# EAGLE schematic FM-Super-Regen-Alt (EAGLE 7.7.0)
Super-Regen FM Radio: "Radio Shack Special" http://ryanzachry.com/2013/01/super-regen-fm-radio/
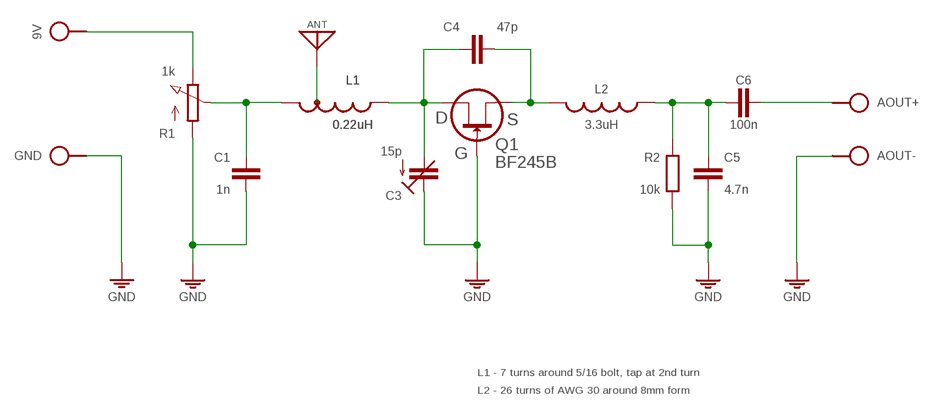
[diagram p0: schematic, sheet 1]

## Parts
9V  SPAD  [SPAD]
ANT  ANT  [SPAD]
AOUT+  SPAD  [SPAD]
AOUT-  SPAD  [SPAD]
C1  1n  C050-020X036/V  [C050-020X036/V]
C3  15p  C-TR-PH201272222-808-2PIN  [TRIM-2222-808]
C4  47p  C050-020X036  [C050-020X036]
C5  4.7n  C050-020X036  [C050-020X036]
C6  100n  C050-020X036  [C050-020X036]
GND  SPAD  [SPAD]
L1  0.22uH  L-TAP108/7V  [L-08/7V-TAP1]
L2  3.3uH  L-BODY  [L-BODY]
Q1  BF245B  [TO92]
R1  1k  POT-V  [POT-V]
R2  10k  R0204/10  [0204/10]

## Nets
GND: AOUT-.1 C1.2 C3.1(E) C5.2 GND.1 Q1.1(G) R1.A R2.1
N$1: 9V.1 R1.E
N$2: C3.2(A) C4.1 L1.2 Q1.3(D)
N$3: C1.1 L1.1 R1.S
N$4: ANT.1 L1.T
N$5: C4.2 L2.3 Q1.2(S)
N$6: C5.1 C6.1 L2.2 R2.2
N$8: AOUT+.1 C6.2

## Notes on the sheet
- L1 - 7 turns around 5/16 bolt, tap at 2nd turn
- L2 - 26 turns of AWG 30 around 8mm form

## Library data of the parts
9V AOUT+ AOUT- GND = pad:SPAD
ANT = pad:ANT
C1 C4-C6 = c:C: CAPACITOR, European symbol
C3 = cap-trim:C-TR-PH20127
L1 = l:L-TAP1
L2 = l:L: Potentiometers Beckman, Copal, Piher, Spectrol, Schukat Created by librarian@cadsoft.de
Q1 = t:BF245B: Transistors
R1 = r:POT
R2 = r:R: RESISTOR, European symbol

## Net classes
0 default: width 0.61 mm